# EasyEDA Pro project ProPrj_主控板v1.0_2025-02-24.epro, board PCB1_1
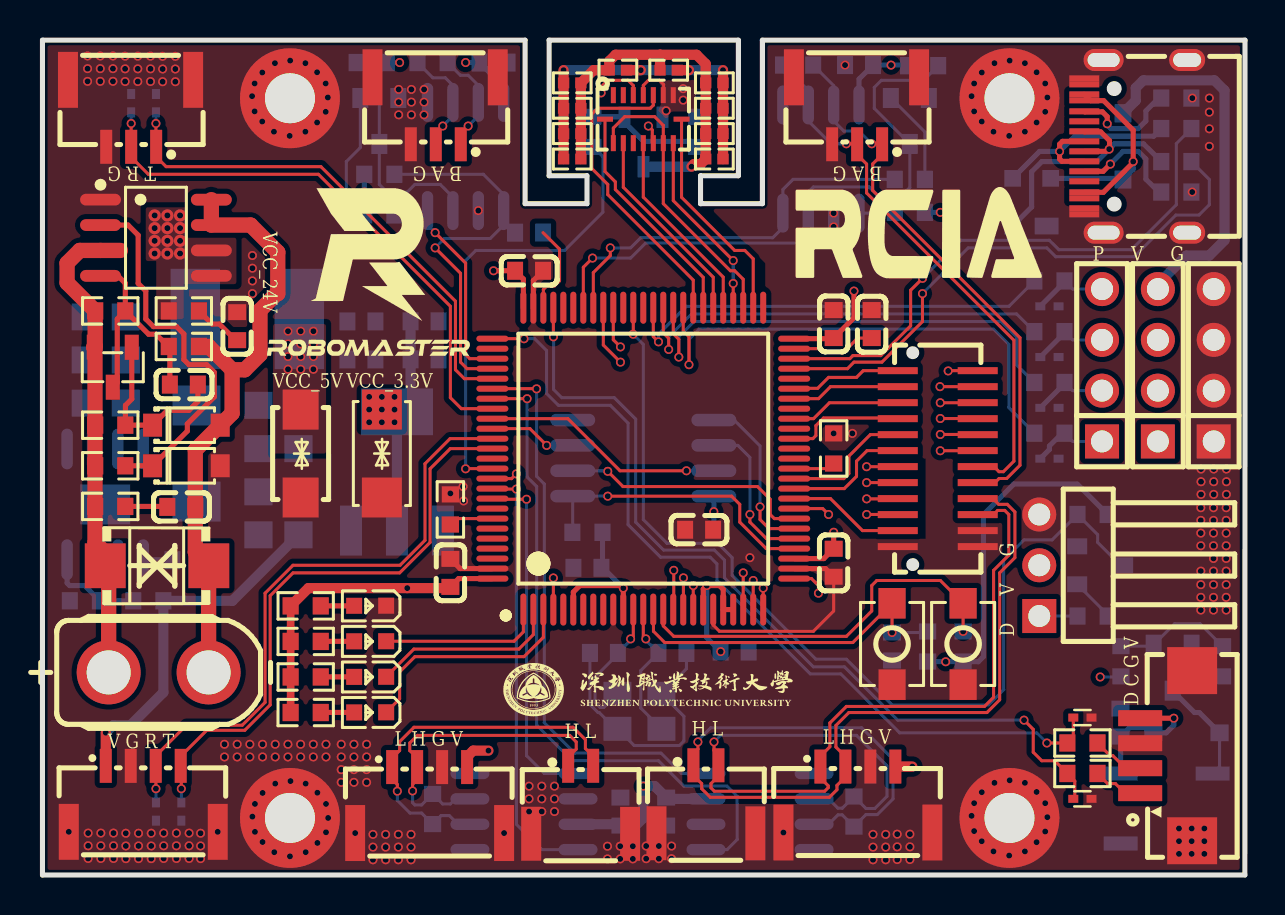
[diagram p10: board, top side]
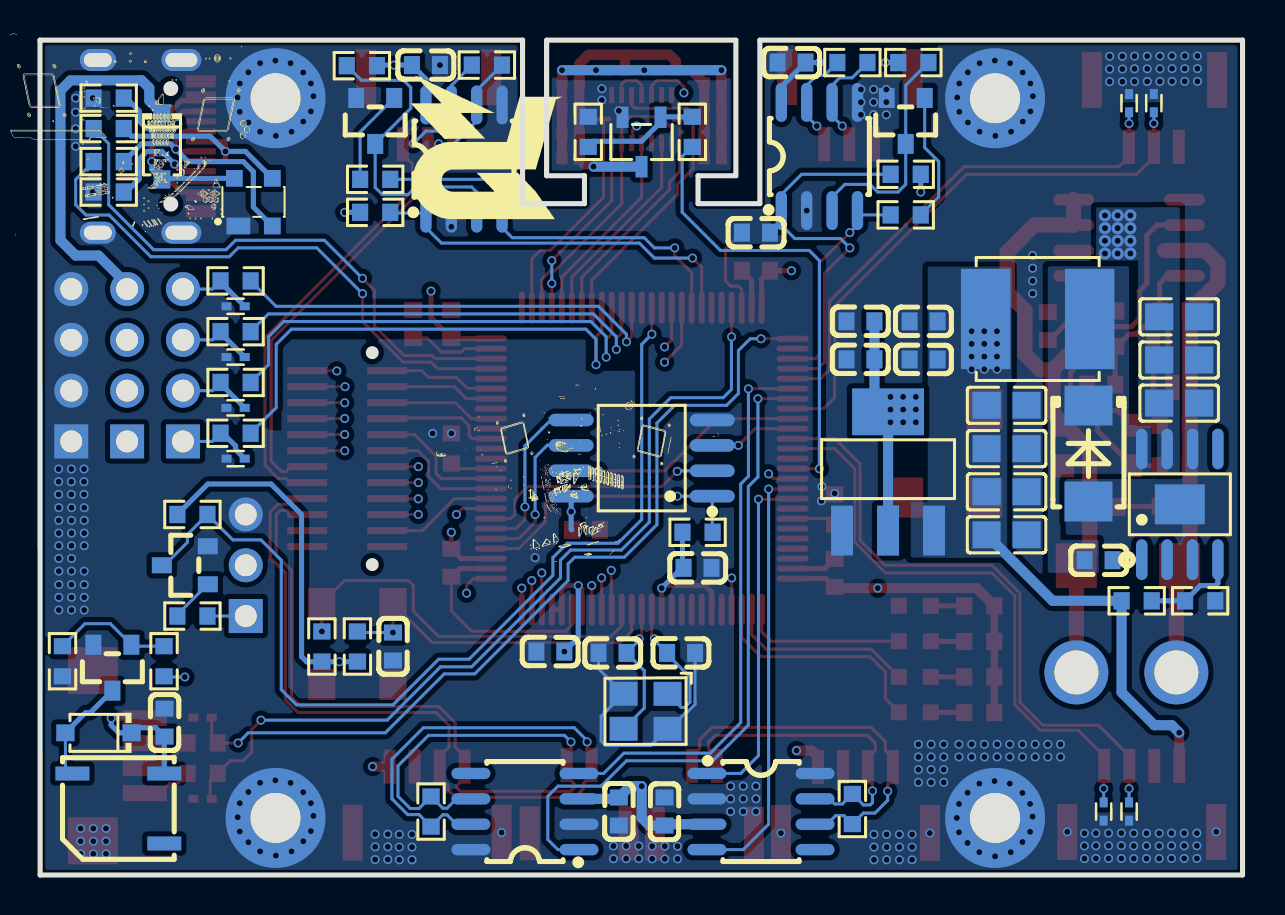
[diagram p11: board, bottom side, seen from below]

Outline 60.17 x 41.76 mm; copper layers: Top Layer, Inner1, Inner2, Bottom Layer. Coordinates in mm from the lower left corner of the outline.
Outline path: 0,0 0,41.76 24.15,41.76 24.15,33.58 27.24,33.58 27.24,34.98 25.35,34.98 25.35,41.76 34.82,41.76 34.82,34.98 32.93,34.98 32.93,33.58 36.02,33.58 36.02,41.76 60.17,41.76 60.16,0 0,0
Stack: Top Layer 0.035mm 外层铜厚1oz / Dielectric1 0.2104mm 7628 RC49% 8.6mil / Inner1 0.0152mm 内层铜厚 / Dielectric2 1.065mm 1.1mm H/HOZ 含铜 / Inner2 0.0152mm 内层铜厚 / Dielectric3 0.2104mm 7628 RC49% 8.6mil / Bottom Layer 0.035mm 外层铜厚1oz

## Design rules (mm)
net OSC_IN: OSC
net OSC_OUT: OSC
net CAN1-H: CAN1
net CAN1-L: CAN1
net CAN2-H: CAN2
net CAN2-L: CAN2
net RS485_1_B: RS485_1
net RS485_1_A: RS485_1
net RS485_4_B: RS485_4
net RS485_4_A: RS485_4
template: 自定义配置
spacing copperThickness1oz (default): track to track 0.102, other pairs 0.152 to 0.3
spacing copperThickness2oz: track to track 0.203, other pairs 0.152 to 0.3
track width copperThickness1oz (default): min 0.127, default 0.254, max 2.54
track width copperThickness2oz: min 0.203, default 0.254, max 2.54
differential pair differentialPair (default): width min 0.127, default 0.254, max 2.54; gap min 0.152, default 0.152
via viaSize (default): diameter min 0.3, default 0.3, max 10; hole min 0.3, default 0.45, max 6.3

## Placement (name value [footprint] x y rotation side)
BUZZER1  4kHz  [BUZ-SMD_L5.0-W5.5-P4.60]  56.25 3.33 0 bottom
C1  100nF  [C0603]  7.07 24.53 180 top
C3  1uF  [C0603]  6.95 18.42 180 top
C4  1uF  [C0603]  9.74 27.45 90 top
C8  100nF  [C0603]  7.2 15.75 0 bottom
C17  12pF  [C0603]  28.09 11.11 180 bottom
C18  12pF  [C0603]  31.52 11.11 0 bottom
C19  100nF  [C0603]  42.51 11.43 270 bottom
C54  100nF  [C0603]  31.2 3.17 270 bottom
C132  4.7uf  [C0805]  3.17 23.6 0 bottom
C133  4.7uf  [C0805]  3.17 25.76 0 bottom
C163  4.7uf  [C0805]  3.17 27.92 0 bottom
C164  4.7uf  [C0805]  11.81 17.02 0 bottom
C165  4.7uf  [C0805]  11.81 19.17 0 bottom
C166  4.7uf  [C0805]  11.81 21.33 0 bottom
C167  4.7uf  [C0805]  11.81 23.5 0 bottom
C170  100nF  [C0603]  34.63 11.18 180 bottom
C171  100nF  [C0603]  20.41 15.11 270 top
C174  100nF  [C0603]  27.27 15.37 0 bottom
C175  100nF  [C0603]  39.59 27.56 270 top
C176  100nF  [C0603]  24.35 30.23 180 top
C177  100nF  [C0603]  39.59 15.62 90 top
C178  100nF  [C0603]  28.92 3.17 90 bottom
C179  10nF  [C0603]  19.12 27.7 180 bottom
C180  100nF  [C0603]  19.12 25.79 180 bottom
C181  100nF  [C0603]  15.96 27.69 180 bottom
C182  100nF  [C0603]  15.96 25.79 180 bottom
C183  22uF  [C0603]  53.94 7.62 270 bottom
C184  100nF  [C0603]  41.49 27.56 90 top
C185  100nF  [C0603]  24.35 32.13 0 bottom
C186  100nF  [C0603]  32.86 17.27 0 top
C187  100nF  [C0603]  40.86 40.51 180 bottom
C188  100nF  [C0603]  22.57 40.64 0 bottom
CN1  HC-1.25-4PWT  [CONN-SMD_4P-P1.25-HC-1.25-4PWT]  56.22 5.97 90 top
CN10  XT30UPB-F30.G.Y  [CONN-TH_XT30UPB-F]  5.81 10.14 0 top
D4  -  [SMB_L4.6-W3.6-LS5.3-BI]  5.73 15.47 180 top
D5  SS34-SMB  [SMB_L4.4-W3.6-LS5.3-RD]  7.71 21.08 270 bottom
D6  ESD9B5.0ST5G  [SOD-923_L0.8-W0.6-LS1.0-BI]  52.03 7.87 180 top
D7  ESD9B5.0ST5G  [SOD-923_L0.8-W0.6-LS1.0-BI]  52.03 3.81 180 top
D8  PRTR5V0U2X  [SOT-143-4_L2.9-W1.3-P1.92-LS2.4-BL]  49.49 33.66 180 bottom
D10  ESD9B5.0ST5G  [SOD-923_L0.8-W0.6-LS1.0-BI]  50.38 20.83 180 bottom
D11  ESD9B5.0ST5G  [SOD-923_L0.8-W0.6-LS1.0-BI]  50.38 23.37 180 bottom
D12  ESD9B5.0ST5G  [SOD-923_L0.8-W0.6-LS1.0-BI]  50.38 25.91 180 bottom
D13  ESD9B5.0ST5G  [SOD-923_L0.8-W0.6-LS1.0-BI]  50.38 28.45 180 bottom
D15  ESD9B5.0ST5G  [SOD-923_L0.8-W0.6-LS1.0-BI]  5.68 3.17 90 bottom
D16  ESD9B5.0ST5G  [SOD-923_L0.8-W0.6-LS1.0-BI]  6.95 3.17 90 bottom
D19  ESD9B5.0ST5G  [SOD-923_L0.8-W0.6-LS1.0-BI]  5.68 38.61 270 bottom
D20  ESD9B5.0ST5G  [SOD-923_L0.8-W0.6-LS1.0-BI]  4.44 38.61 270 bottom
D21  SMAJ5.0CA  [SMA_L4.4-W2.8-LS5.1-BI]  12.92 21.08 90 top
D22  SMAJ3.3CA  [SMA_L4.3-W2.6-LS5.1-BI]  16.98 21.08 90 top
H2  -  [HDR-TH_4P-P2.54-V-M]  53.01 25.5 90 top
H3  -  [HDR-TH_4P-P2.54-V-M]  55.81 25.5 90 top
H4  -  [HDR-TH_4P-P2.54-V-M]  58.6 25.5 90 top
J1  GH1.25-4P  [CONN-SMD_4P-P1.25_GH1.25-4PLI]  19.37 3.75 0 top
J2  GH1.25-4P  [CONN-SMD_4P-P1.25_GH1.25-4PLI]  40.8 3.78 0 top
J4  GH1.25-4P  [CONN-SMD_4P-P1.25_GH1.25-4PLI]  5.04 3.81 0 top
L2  15uH  [IND-SMD_L6.0-W6.0_SWPA6045S]  10.25 27.81 0 bottom
LED2  -  [LED_0603]  16.35 13.46 180 top
LED3  -  [LED_0603]  16.35 11.68 180 top
LED4  -  [LED_0603]  16.35 9.91 180 top
LED5  -  [LED_0603]  16.35 8.13 180 top
NOREF  -  [Pad_e5538]  48.38 38.86 90 top
NOREF#2  -  [Pad_e5542]  12.38 38.85 90 top
NOREF#3  -  [Pad_e5541]  12.38 2.86 90 top
NOREF#4  -  [Pad_e5539]  48.38 2.86 90 top
Q6  -  [S8050_SOT-23]  52.92 15.37 180 bottom
Q29  NCE4614  [SOIC-8_L4.9-W3.9-P1.27-LS6.0-BL]  5.68 31.88 270 top
Q30  -  [SOT-23-3_L2.9-W1.3-P1.90-LS2.4-BR]  3.52 25.4 90 top
Q31  -  [S8050_SOT-23]  56.42 10.37 90 bottom
Q32  CJ2310  [SOT-23-3_L2.9-W1.6-P1.90-LS2.8-BR]  30.07 36.67 90 bottom
Q33  -  [S8050_SOT-23]  43.27 37.72 90 bottom
Q34  -  [S8050_SOT-23]  16.73 37.72 90 bottom
R2  100kΩ  [R0603]  3.39 20.47 180 top
R3  100kΩ  [R0603]  3.39 22.5 180 top
R4  22Ω  [R0603]  7.07 28.22 180 top
R6  10kΩ  [R0603]  3.39 28.22 180 top
R13  10K  [R0603]  44.29 11.43 270 bottom
R14  10K  [R0603]  13.17 13.46 0 top
R16  10K  [R0603]  20.41 18.29 270 top
R20  4.7k  [R0603]  5.3 13.72 0 bottom
R95  1.5k  [R0603]  2.12 13.72 0 bottom
R150  120R  [R0603]  19.52 3.3 90 bottom
R151  120R  [R0603]  40.6 3.17 270 bottom
R152  22Ω  [R0603]  3.39 18.44 180 top
R153  10kΩ  [R0603]  7.07 26.44 180 top
R154  4.7kΩ  [R0603]  52.54 18.03 180 bottom
R155  4.7kΩ  [R0603]  52.54 12.95 180 bottom
R156  22R  [R0603]  52.03 6.6 0 top
R157  22R  [R0603]  52.03 5.08 0 top
R158  10K  [R0603]  46.06 11.43 270 bottom
R159  10K  [R0603]  59.04 10.69 270 bottom
R160  22R  [R0603]  53.96 10.69 90 bottom
R161  22R  [R0603]  56.73 38.86 180 bottom
R162  22R  [R0603]  56.73 34.16 0 bottom
R163  100R  [R0603]  27.53 37.17 90 bottom
R164  10K  [R0603]  32.74 37.17 90 bottom
R165  470R  [R0402]  26.51 37.08 180 top
R166  470R  [R0402]  26.51 38.35 180 top
R167  470R  [R0402]  26.51 39.62 180 top
R168  470R  [R0402]  28.79 40.26 0 top
R169  470R  [R0402]  31.33 40.26 0 top
R170  470R  [R0402]  33.62 39.62 0 top
R171  470R  [R0402]  33.62 38.35 0 top
R172  470R  [R0402]  33.62 37.08 0 top
R173  470R  [R0402]  33.62 35.81 0 top
R174  470R  [R0402]  26.51 35.81 180 top
R175  10K  [R0603]  13.17 11.68 0 top
R176  10K  [R0603]  13.17 9.91 0 top
R177  10K  [R0603]  13.17 8.13 0 top
R178  22R  [R0603]  50.38 22.1 0 bottom
R179  22R  [R0603]  50.38 24.64 0 bottom
R180  22R  [R0603]  50.38 27.18 0 bottom
R181  22R  [R0603]  50.38 29.72 0 bottom
R182  22R  [R0603]  56.73 37.34 0 bottom
R183  22R  [R0603]  56.73 35.69 0 bottom
R184  10K  [R0603]  27.27 17.14 0 bottom
R185  10k  [R0603]  43.4 33.15 0 bottom
R186  120R  [R0603]  37.81 40.51 0 bottom
R187  10k  [R0603]  44.06 40.48 180 bottom
R188  10k  [R0603]  43.4 34.8 180 bottom
R189  10k  [R0603]  16.85 35.05 180 bottom
R190  120R  [R0603]  19.52 40.64 0 bottom
R191  10k  [R0603]  16.47 40.64 0 bottom
R192  10k  [R0603]  16.85 33.02 0 bottom
R193  10K  [R0603]  39.59 21.34 270 top
SW1  轻触按键3*4*H  [SW-SMD_L4.0-W2.9-LS5.0]  42.51 11.56 90 top
SW2  轻触按键3*4*H  [SW-SMD_L4.0-W2.9-LS5.0]  46.06 11.56 270 top
U1  STM32F407VET6  [LQFP-100_L14.0-W14.0-P0.50-LS16.0-BL]  30.06 20.83 0 top
U4  -  [SOIC-8_L5.0-W4.0-P1.27-LS6.0-BL-EP2.0]  3.14 18.54 180 bottom
U9  BMI088  [LGA-16_L4.5-W3.0-P0.50-BL]  30.06 37.81 270 top
U10  -  [SOIC-8_L5.0-W4.0-P1.27-LS6.0-BL]  24.09 3.17 270 bottom
U11  GH1.25-2P卧贴  [CONN-SMD_2P-P1.25_GH1.25-2P]  26.93 3.76 0 top
U12  -  [SOIC-8_L5.0-W4.0-P1.27-LS6.0-BL]  35.9 3.17 90 bottom
U14  GH1.25-2P卧贴  [CONN-SMD_2P-P1.25_GH1.25-2P]  33.19 3.79 0 top
U15  AMS1117-3.3  [SOT-223-3_L6.5-W3.4-P2.30-LS7.0-BR]  17.74 20.2 270 bottom
U18  X6511WR-03H-C30D60R2  [HDR-TH_3P-P2.54-H-M-W9.7-N]  49.87 15.49 90 top
U19  SD103AWS  [SOD-123_L2.7-W1.7-LS3.8-RD]  57.24 7.11 0 bottom
U20  SD103AWS  [SOD-123_L2.7-W1.7-LS3.8-RD]  54.06 36.45 270 bottom
U21  GH1.25-3P卧贴  [CONN-SMD_GH1.25-3P]  4.41 38.1 180 top
U22  W25Q64JVSSIQ  [SOIC-8_L5.3-W5.3-P1.27-LS8.0-BL]  30.06 20.86 90 bottom
U24  SP3485EN-L/TR  [SOIC-8_L5.0-W4.0-P1.27-LS6.0-BL]  38.95 35.81 180 bottom
U26  GH1.25-3P卧贴  [CONN-SMD_GH1.25-3P]  40.73 38.23 180 top
U27  SP3485EN-L/TR  [SOIC-8_L5.0-W4.0-P1.27-LS6.0-BL]  21.17 35.94 180 bottom
U28  GH1.25-3P卧贴  [CONN-SMD_GH1.25-3P]  19.65 38.23 180 top
U29  SGDBF-08-024P-H40  [CONN-SMD_24P-P0.80_SGDBF-08-024P-H40]  44.79 20.83 270 top
USB1  TYPE-C母座16P不绣钢  [TYPE-C-SMD_16P-EH4]  54.7 36.45 90 top
X3  12MHz  [OSC-SMD_4P-L3.2-W2.5-BL]  29.87 8.19 0 bottom
ZD1  MMSZ5239B  [SOD-123_L2.8-W1.8-LS3.7-RD]  7.2 20.47 0 top
ZD2  MMSZ5239B  [SOD-123_L2.8-W1.8-LS3.7-RD]  7.2 22.5 0 top

## Footprints (pads in the part's own frame, mm; a bottom-side part is the same pattern mirrored in y, then rotated)
BUZ-SMD_L5.0-W5.5-P4.60
  rect 1.7x0.7 smd: 1(-2.3,-1.75) 2(2.3,-1.75) 3(-2.3,1.75)
C0603
  rect 0.8x0.9 smd: 1(-0.7,0) 2(0.7,0)
C0805
  rect 1.41x1.35 smd: 1(-1,0) 2(1,0)
CONN-SMD_2P-P1.25_GH1.25-2P
  rect 0.6x1.7 smd: 1(-0.625,1.702) 2(0.625,1.702)
  rect 1x2.7 smd: 3(2.475,-1.702) 4(-2.475,-1.698)
CONN-SMD_4P-P1.25-HC-1.25-4PWT
  rect 0.8x2.2 smd: 1(-1.875,1.3) 2(-0.625,1.3) 3(0.625,1.3) 4(1.875,1.3)
  rect 2.35x2.5 smd: 5(4.255,-1.3) 6(-4.255,-1.3)
CONN-SMD_4P-P1.25_GH1.25-4PLI
  rect 0.6x1.7 smd: 1(-1.875,1.65) 2(-0.625,1.65) 3(0.625,1.65) 4(1.875,1.65)
  rect 1x2.8 smd: 5(-3.725,-1.65) 6(3.725,-1.65)
CONN-SMD_24P-P0.80_SGDBF-08-024P-H40
  rect 0.35x2 smd: 1(-4.4,-2) 2(-3.6,-2) 3(-2.8,-2) 4(-2,-2) 5(-1.2,-2) 6(-0.4,-2) 7(0.4,-2) 8(1.2,-2) 9(2,-2) 10(2.8,-2) 11(3.6,-2) 12(4.4,-2) 13(4.4,2) 14(3.6,2) 15(2.8,2) 16(2,2) 17(1.2,2) 18(0.4,2) 19(-0.4,2) 20(-1.2,2) 21(-2,2) 22(-2.8,2) 23(-3.6,2) 24(-4.4,2)
CONN-SMD_GH1.25-3P
  rect 0.6x1.7 smd: 1(-1.282,1.675) 2(-0.032,1.675) 3(1.218,1.675)
  rect 1x2.8 smd: 4(-3.132,-1.675) 5(3.132,-1.675)
CONN-TH_XT30UPB-F
  round 3.2 hole 2.2: 1(-2.5,0) 2(2.5,0)
HDR-TH_3P-P2.54-H-M-W9.7-N
  rect 1.7x1.7 hole 1.1: 1(-2.54,0)
  round 1.7 hole 1.1: 2(0,0) 3(2.54,0)
HDR-TH_4P-P2.54-V-M
  rect 1.7x1.7 hole 1.1: 1(-3.81,0)
  round 1.7 hole 1.1: 2(-1.27,0) 3(1.27,0) 4(3.81,0)
IND-SMD_L6.0-W6.0_SWPA6045S
  rect 2.474x5.02 smd: 1(-2.603,0) 2(2.603,0)
LED_0603
  rect 0.8x0.8 smd: 1(-0.851,-0.01) 2(0.75,-0.005)
LGA-16_L4.5-W3.0-P0.50-BL
  rect 0.8x0.25 smd: 1(-1.2,-1.498) 2(-1.2,-0.998) 3(-1.2,-0.498) 4(-1.2,0.002) 5(-1.2,0.502) 6(-1.2,1.002) 7(-1.2,1.502) 9(1.2,1.502) 10(1.2,1.002) 11(1.2,0.502) 12(1.2,0.002) 13(1.2,-0.498) 14(1.2,-0.998) 15(1.2,-1.498)
  rect 0.25x0.8 smd: 8(0,1.915) 16(0,-1.915)
LQFP-100_L14.0-W14.0-P0.50-LS16.0-BL
  oval 0.3x1.6 smd: 1(-6,-7.55) 2(-5.5,-7.55) 3(-5,-7.55) 4(-4.5,-7.55) 5(-4,-7.55) 6(-3.5,-7.55) 7(-3,-7.55) 8(-2.5,-7.55) 9(-2,-7.55) 10(-1.5,-7.55) 11(-1,-7.55) 12(-0.5,-7.55) 13(0,-7.55) 14(0.5,-7.55) 15(1,-7.55) 16(1.5,-7.55) 17(2,-7.55) 18(2.5,-7.55) 19(3,-7.55) 20(3.5,-7.55) 21(4,-7.55) 22(4.5,-7.55) 23(5,-7.55) 24(5.5,-7.55) 25(6,-7.55) 51(6,7.55) 52(5.5,7.55) 53(5,7.55) 54(4.5,7.55) 55(4,7.55) 56(3.5,7.55) 57(3,7.55) 58(2.5,7.55) 59(2,7.55) 60(1.5,7.55) 61(1,7.55) 62(0.5,7.55) 63(0,7.55) 64(-0.5,7.55) 65(-1,7.55) 66(-1.5,7.55) 67(-2,7.55) 68(-2.5,7.55) 69(-3,7.55) 70(-3.5,7.55) 71(-4,7.55) 72(-4.5,7.55) 73(-5,7.55) 74(-5.5,7.55) 75(-6,7.55)
  oval 1.6x0.3 smd: 26(7.55,-6) 27(7.55,-5.5) 28(7.55,-5) 29(7.55,-4.5) 30(7.55,-4) 31(7.55,-3.5) 32(7.55,-3) 33(7.55,-2.5) 34(7.55,-2) 35(7.55,-1.5) 36(7.55,-1) 37(7.55,-0.5) 38(7.55,0) 39(7.55,0.5) 40(7.55,1) 41(7.55,1.5) 42(7.55,2) 43(7.55,2.5) 44(7.55,3) 45(7.55,3.5) 46(7.55,4) 47(7.55,4.5) 48(7.55,5) 49(7.55,5.5) 50(7.55,6) 76(-7.55,6) 77(-7.55,5.5) 78(-7.55,5) 79(-7.55,4.5) 80(-7.55,4) 81(-7.55,3.5) 82(-7.55,3) 83(-7.55,2.5) 84(-7.55,2) 85(-7.55,1.5) 86(-7.55,1) 87(-7.55,0.5) 88(-7.55,0) 89(-7.55,-0.5) 90(-7.55,-1) 91(-7.55,-1.5) 92(-7.55,-2) 93(-7.55,-2.5) 94(-7.55,-3) 95(-7.55,-3.5) 96(-7.55,-4) 97(-7.55,-4.5) 98(-7.55,-5) 99(-7.55,-5.5) 100(-7.55,-6)
OSC-SMD_4P-L3.2-W2.5-BL
  rect 1.4x1.2 smd: 1(-1.1,-0.875) 2(1.1,-0.875) 3(1.1,0.875) 4(-1.1,0.875)
Pad_e5538
  round 5 hole 2.5: 101(0,0)
Pad_e5539
  round 5 hole 2.5: 101(0,0)
Pad_e5541
  round 5 hole 2.5: 101(0,0)
Pad_e5542
  round 5 hole 2.5: 101(0,0)
R0402
  rect 0.566x0.54 smd: 1(-0.433,0) 2(0.433,0)
R0603
  rect 0.806x0.864 smd: 1(-0.753,0) 2(0.753,0)
S8050_SOT-23
  rect 1x0.8 smd: 1(1.15,-0.823) 2(1.15,1.077) 3(-1.15,0.127)
SMA_L4.3-W2.6-LS5.1-BI
  rect 2x2 smd: 1(-2.2,0) 2(2.2,0)
SMA_L4.4-W2.8-LS5.1-BI
  rect 2x1.8 smd: 1(-2.2,0) 2(2.2,0)
SMB_L4.4-W3.6-LS5.3-RD
  rect 2x2.4 smd: 1(-2.4,0) 2(2.4,0)
SMB_L4.6-W3.6-LS5.3-BI
  rect 2.047x2.24 smd: 1(-2.591,0) 2(2.591,0)
SOD-123_L2.7-W1.7-LS3.8-RD
  rect 0.91x0.84 smd: 1(-1.655,0) 2(1.655,0)
SOD-123_L2.8-W1.8-LS3.7-RD
  rect 0.95x1.15 smd: 1(-1.692,0) 2(1.692,0)
SOD-923_L0.8-W0.6-LS1.0-BI
  rect 0.5x0.4 smd: 1(-0.457,0) 2(0.457,0)
SOIC-8_L4.9-W3.9-P1.27-LS6.0-BL
  oval 0.588x2.045 smd: 1(-1.905,-2.772) 2(-0.635,-2.772) 3(0.635,-2.772) 4(1.905,-2.772) 5(1.905,2.772) 6(0.635,2.772) 7(-0.635,2.772) 8(-1.905,2.772)
SOIC-8_L5.0-W4.0-P1.27-LS6.0-BL
  oval 0.569x1.95 smd: 1(-1.905,-2.705) 2(-0.635,-2.705) 3(0.635,-2.705) 4(1.905,-2.705) 5(1.905,2.705) 6(0.635,2.705) 7(-0.635,2.705) 8(-1.905,2.705)
SOIC-8_L5.0-W4.0-P1.27-LS6.0-BL-EP2.0
  oval 0.574x2.037 smd: 1(-1.905,-2.768) 2(-0.635,-2.768) 3(0.635,-2.768) 4(1.905,-2.768) 5(1.905,2.768) 6(0.635,2.768) 7(-0.635,2.768) 8(-1.905,2.768)
  rect 2.5x2 smd: 9(0,0)
SOIC-8_L5.3-W5.3-P1.27-LS8.0-BL
  oval 0.63x2.25 smd: 1(-1.905,-3.53) 2(-0.635,-3.53) 3(0.635,-3.53) 4(1.905,-3.53) 5(1.905,3.53) 6(0.635,3.53) 7(-0.635,3.53) 8(-1.905,3.53)
SOT-23-3_L2.9-W1.3-P1.90-LS2.4-BR
  rect 1.25x0.7 smd: 1(1,-0.95) 2(1,0.95) 3(-1,0)
SOT-23-3_L2.9-W1.6-P1.90-LS2.8-BR
  rect 1.07x0.6 smd: 1(1.235,-0.95) 2(1.235,0.95) 3(-1.235,0)
SOT-143-4_L2.9-W1.3-P1.92-LS2.4-BL
  rect 1.194x0.838 smd: 1(-0.75,-1.192)
  rect 0.838x0.838 smd: 2(0.95,-1.192) 3(0.95,1.192) 4(-0.95,1.192)
SOT-223-3_L6.5-W3.4-P2.30-LS7.0-BR
  rect 2.5x1.1 smd: 1(2.97,-2.3) 2(2.97,0) 3(2.97,2.3)
  rect 2.34x3.6 smd: 4(-2.97,0)
SW-SMD_L4.0-W2.9-LS5.0
  rect 1.53x1.36 smd: 1(-2.035,0) 2(2.035,0)
TYPE-C-SMD_16P-EH4
  oval 1.1x2 hole 0.7x1.6: 1(-4.32,1.606) 1(4.32,1.606)
  oval 1.1x1.8 hole 0.7x1.4: 1(-4.32,-2.574) 1(4.32,-2.574)
  rect 0.3x1.5 smd: A1(-3.4,2.573) A4(-2.6,2.573) A5(-1.25,2.573) A6(-0.25,2.573) A7(0.25,2.573) A8(1.25,2.574) A9(2.6,2.574) A12(3.4,2.573) B1(3.1,2.573) B4(2.3,2.574) B5(1.75,2.573) B6(0.75,2.573) B7(-0.75,2.573) B8(-1.75,2.574) B9(-2.3,2.573) B12(-3.1,2.573)

## Nets
As in the schematic, except:
GND: C4.2 C17.2 C18.2 C19.2 C54.2 C132.1 C133.1 C163.1 C164.1 C165.1 C166.1 C167.1 C170.1 C171.1 C174.1 C175.1 C176.1 C177.1 C178.2 C179.1 C180.1 C181.1 C182.1 C183.1 C184.2 C185.2 C186.2 C187.2 C188.2 CN1.3 CN1.5 CN1.6 D5.2 D6.1 D7.1 D8.1 D10.1 D11.1 D12.1 D13.1 D15.1 D16.1 D19.1 D20.1 D21.1 D22.1 H4.1 H4.2 H4.3 H4.4 J1.3 J1.5 J1.6 J2.3 J2.5 J2.6 J4.2 J4.5 J4.6 LED2.1 NOREF.101 NOREF#2.101 NOREF#3.101 NOREF#4.101 Q6.2 Q29.1 Q31.2 Q32.2 Q33.2 Q34.2 R16.1 R95.1 R159.2 R161.1 R162.2 R164.2 R193.1 SW1.1 SW2.2 U1.10 U1.20 U1.27 U1.74 U1.99 U4.6 U4.9 U9.4 U9.6 U9.7 U10.2 U10.8 U11.3 U11.4 U12.2 U12.8 U14.3 U14.4 U15.1 U18.3 U21.3 U21.4 U21.5 U22.4 U24.2 U24.5 U26.3 U26.4 U26.5 U27.2 U27.5 U28.3 U28.4 U28.5 U29.12 U29.13 U29.14 USB1.1 USB1.A1 USB1.A12 USB1.B1 USB1.B12 X3.2 X3.4 ZD1.2
GROUND: C3.1 CN10.2 D4.1 Q29.7 Q29.8 R153.1 ZD2.2
$2N1757: C1.1 Q30.1 R3.1 ZD2.1

Pads without a net: BUZZER1 3; U1 5 7 8 9 38 39 41 43 46 51 63 65 70 71 77 88 90 93 97 98; U4 2 3 5; U9 1 2 13; U10 5; U12 5; USB1 A8 B8

## Via types
v1: diameter 0.45, hole 0.3, Top Layer to Bottom Layer, 394 vias
v2: diameter 0.61, hole 0.305, Top Layer to Bottom Layer, 12 vias

## Routing (per net, layer and track width the routed paths; a pad name or vN(x,y) marks a point on that pad's centre or on a via; arc(x,y) is an arc through that point)
5V_FB: length 4.8
  Bottom Layer w0.254: R20.1 R95.2 2.11,14.48 1.36,14.48 1.23,14.61 1.23,15.77
GND: length 31.4
  Top Layer w0.152: U9.4 30.06,39.5 30.32,39.75 30.87,39.75 31.08,39.54 31.08,39.02 U9.6 ; C177.1 39.59,13.21 38.57,12.19 33.87,12.19 33.56,12.5 U1.20
  Top Layer w0.254: U1.99 20.89,15.33 C171.1 ; U1.27 39.18,15.33 C177.1 ; C176.1 24.56,29.74 U1.74
  Bottom Layer w0.152: C18.2 32.22,10.31 30.97,9.06 32.09,7.94 32.09,6.71 31.87,6.48 29.61,6.48 X3.4 28.67,7.31 27.85,8.13 27.8,8.13 27.39,8.53 27.39,8.69 27.39,8.69 C17.2
  vias: v1(1.32,2.16) v1(2.26,40.97) v1(2.26,40.33) v1(2.26,39.7) v1(2.28,2.1) v1(2.28,1.46) v1(2.28,0.83) v1(2.89,40.97) v1(2.89,40.33) v1(2.89,39.7) v1(2.92,2.1) v1(2.92,1.46) v1(2.92,0.83) v1(3.53,40.97) v1(3.53,40.33) v1(3.53,39.7) v1(3.55,2.1) v1(3.55,1.46) v1(3.55,0.83) v1(4.13,40.96) v1(4.13,40.33) v1(4.13,39.69) v1(4.17,2.09) v1(4.17,1.45) v1(4.17,0.82) v1(4.77,40.96) v1(4.77,40.33) v1(4.77,39.69) v1(4.81,2.09) v1(4.81,1.45) v1(4.81,0.82) v1(5.4,40.96) v1(5.4,40.33) v1(5.4,39.69) v1(5.44,2.09) v1(5.44,1.45) v1(5.44,0.82) v1(6.01,40.95) v1(6.01,40.32) v1(6.01,39.68) v1(6.07,2.1) v1(6.07,1.46) v1(6.07,0.83) v1(6.65,40.95) v1(6.65,40.32) v1(6.65,39.68) v1(6.7,2.1) v1(6.7,1.46) v1(6.7,0.83) v1(7.34,2.1) v1(7.34,1.46) v1(7.34,0.83) v1(7.91,2.09) v1(7.91,1.45) v1(7.91,0.82) v1(8.77,2.16) v1(9.11,6.54) v1(9.11,5.91) v1(9.74,6.54) v1(9.74,5.91) v1(10.38,6.54) v1(10.38,5.91) v1(10.49,38.96) v1(10.5,30.99) v1(10.5,30.35) v1(10.5,29.72) v1(10.5,29.08) v1(10.5,2.92) v1(10.62,39.59) v1(10.62,38.2) v1(10.63,3.56) v1(10.63,2.16) v1(11,40.14) v1(11,37.69) v1(11.01,6.54) v1(11.01,5.91) v1(11.01,1.65) v1(11.01,4.11) v1(11.58,37.18) v1(11.6,1.14) v1(11.63,40.61) v1(11.65,6.54) v1(11.65,5.91) v1(11.65,4.57) v1(12.28,6.54) v1(12.28,5.91) v1(12.39,40.74) v1(12.37,36.97) v1(12.41,4.7) v1(12.38,0.93) v1(12.92,6.54) v1(12.92,5.91) v1(13.16,40.61) v1(13.16,37.18) v1(13.17,4.57) v1(13.17,1.14) v1(13.55,6.54) v1(13.55,5.91) v1(13.74,40.15) v1(13.74,37.64) v1(13.76,4.12) v1(13.76,1.6) v1(14.17,39.59) v1(14.17,38.18) v1(14.19,6.54) v1(14.19,5.91) v1(14.19,3.56) v1(14.19,2.14) v1(14.28,38.89) v1(14.29,2.86) v1(14.95,6.54) v1(14.95,5.91) v1(14.95,5.27) v1(14.95,4.64) v1(15.58,6.54) v1(15.58,5.91) v1(15.58,5.27) v1(15.58,4.64) v1(15.65,2.1) v1(16.22,6.54) v1(16.22,5.91) v1(16.22,5.27) v1(16.22,4.64) v1(16.54,2.03) v1(16.54,1.4) v1(16.54,0.76) v1(17.17,2.03) v1(17.17,1.4) v1(17.17,0.76) v1(17.81,2.03) v1(17.81,1.4) v1(17.81,0.76) v1(17.82,39.3) v1(17.82,38.66) v1(17.82,38.03) v1(18.46,39.3) v1(18.46,38.66) v1(18.46,38.03) v1(18.44,2.03) v1(18.44,1.4) v1(18.44,0.76) v1(19.09,39.3) v1(19.09,38.66) v1(19.09,38.03) v1(20.41,19.09) v1(21.04,19.43) v1(21.07,18.71) v1(21.81,33.24) v1(23.1,2.1) v1(24.35,4.45) v1(24.35,3.81) v1(24.35,3.17) v1(24.98,4.45) v1(24.98,3.81) v1(24.98,3.17) v1(25.62,4.45) v1(25.62,3.81) v1(25.62,3.17) v1(28.27,1.44) v1(28.27,0.81) v1(28.9,1.44) v1(28.9,0.81) v1(29.54,1.44) v1(29.54,0.81) v1(30.2,1.45) v1(30.2,0.82) v1(30.84,1.45) v1(30.84,0.82) v1(31.2,38.23) v1(31.47,1.45) v1(31.47,0.82) v1(32.06,39.33) v1(32.06,38.76) v1(35.4,15.88) v1(37.07,2.12) v1(39.59,33.86) v1(39.59,33.11) v1(39.59,32.42) v1(39.59,22.09) v1(40.16,40.51) v1(40.52,22.09) v1(41.56,2.03) v1(41.56,1.4) v1(41.56,0.76) v1(42.19,2.03) v1(42.19,1.4) v1(42.19,0.76) v1(42.77,2.04) v1(42.77,1.41) v1(42.77,0.77) v1(43.4,2.04) v1(43.4,1.41) v1(43.4,0.77) v1(46.49,38.96) v1(46.49,2.96) v1(46.61,39.59) v1(46.61,38.2) v1(46.61,3.59) v1(46.61,2.2) v1(47,40.14) v1(47,37.69) v1(47,4.14) v1(47,1.69) v1(47.58,37.18) v1(47.58,1.18) v1(47.63,40.61) v1(47.63,4.61) v1(48.39,40.74) v1(48.37,36.97) v1(48.39,4.74) v1(48.37,0.97) v1(49.15,40.61) v1(49.15,37.18) v1(49.15,4.61) v1(49.15,1.18) v1(49.74,40.15) v1(49.74,37.64) v1(49.74,4.15) v1(49.74,1.64) v1(50.17,39.59) v1(50.17,38.18) v1(50.17,3.59) v1(50.17,2.18) v1(50.28,38.89) v1(50.28,2.89) v1(56.86,2.33) v1(56.86,1.69) v1(56.86,1.06) v1(57.5,2.33) v1(57.5,1.69) v1(57.5,1.06) v1(57.53,38.86) v1(57.53,34.16) v1(57.97,20.31) v1(57.97,19.67) v1(57.97,19.04) v1(57.96,18.37) v1(57.96,17.74) v1(57.96,17.1) v1(57.96,16.47) v1(57.96,15.2) v1(57.96,14.52) v1(57.96,13.89) v1(57.96,13.25) v1(58.13,2.33) v1(58.13,1.69) v1(58.13,1.06) v1(58.38,38.86) v1(58.38,38.16) v1(58.38,37.33) v1(58.38,36.45) v1(58.6,20.31) v1(58.6,19.67) v1(58.6,19.04) v1(58.59,18.37) v1(58.59,17.74) v1(58.59,17.1) v1(58.59,16.47) v1(58.59,15.84) v1(58.59,15.2) v1(58.59,14.52) v1(58.59,13.89) v1(58.59,13.25) v1(59.24,20.31) v1(59.24,19.67) v1(59.24,19.04) v1(59.23,18.37) v1(59.23,17.74) v1(59.23,17.1) v1(59.23,16.47) v1(59.23,15.84) v1(59.23,15.2) v1(59.23,14.52) v1(59.23,13.89) v1(59.23,13.25)
VCC_3.3V: length 131.2
  Top Layer w0.152: v1(30.32,37.47) 30.51,37.27 30.51,36.66 U9.11 ; U9.3 29.56,39.49 29.3,39.75 28.28,39.75 27.95,39.42 v1(27.95,39.12)
  Top Layer w0.254: v1(22.57,30.23) C176.2 24.06,29.81 U1.75 ; v1(39.59,17.14) 39.59,16.32 39.09,15.83 U1.28 ; U1.11 v1(29.06,14.35) 28.93,14.48 26.89,14.48 26.56,14.15 U1.6 ; U1.100 20.82,14.83 C171.2 ; v1(40.6,29.21) 40.6,27.88 39.56,26.83 U1.50 ; U1.22 U1.21 34.06,14.29 33.87,14.48 v1(33.24,14.48) 33.06,14.3 U1.19 ; CN1.4 v1(56.6,7.84)
  Top Layer w0.381: R14.1 R175.1 R176.1 R177.1
  Top Layer w0.508: C171.2 20.35,14.35 v1(18.25,14.35) 13.31,14.35 R14.1
  Inner1 w0.508: v1(27.95,39.12) 29.61,37.47 v1(30.32,37.47) 30.32,34.94 27.89,32.51 23.46,32.51 22.31,33.66 22.31,39.5 v1(21.17,40.64) v1(17.87,40.64) ; v1(56.6,7.84) 56.6,8.89 55.97,9.53 54.95,9.53 53.81,10.67 v1(45.19,10.67)
  Bottom Layer w0.254: 46.07,10.67 46.83,10.67 47.08,10.92 47.08,18.03 48.6,19.56 51.77,19.56 R154.1 ; 46.07,10.67 R158.2 ; 46.07,10.67 v1(45.19,10.67) 44.29,10.67 R13.2 ; R191.2 v1(17.87,40.64) ; R184.2 28.02,15.42 C174.2 28.05,15.37 v1(29.06,14.35) ; U24.8 40.86,39.81 41.56,40.51 v1(42.46,40.51) 43.28,40.51 R187.2 ; U27.8 23.08,39.43 C188.1 v1(21.17,40.64) ; v1(33.93,11.18) 33.24,11.87 v1(33.24,14.48) ; R185.2 v1(44.92,33.15) ; R189.2 v1(16.1,34.16) ; 33.56,17.27 33.59,17.31 v1(33.59,18.17) U22.8 ; v1(56.6,7.84) 56.6,7.49 56.22,7.11 U19.1 55.33,7.37 54.38,7.37 C183.2 53.95,6.91 BUZZER1.1
  Bottom Layer w0.508: C179.2 C180.2 18.42,23.85 U15.4 U15.2
  vias: v1(16.35,23.92) v1(16.35,23.28) v1(16.35,22.65) v1(16.98,23.92) v1(16.98,23.28) v1(16.98,22.65) v1(17.62,23.92) v1(17.62,23.28) v1(17.62,22.65)
VCC_5V: length 47.4
  Top Layer w0.508: J1.4 21.25,5.92 21.55,6.22 v1(22.31,6.22) ; v1(3.17,7.12) J4.1 ; 42.67,5.42 v1(43.52,5.42)
  Bottom Layer w0.508: H3.4 55.81,29.56 57.24,30.99 58.38,30.99 59.14,31.75 59.14,39.24 58.64,39.75 55.08,39.75 54.7,39.37 54.7,38.74 U20.1 ; v1(3.17,7.12) 3.54,7.49 4.41,7.49 6.05,9.14 R20.2 9.5,13.72 C164.2 ; U10.3 28.85,2.54 C178.1 29.68,2.47 30.06,2.86 v1(30.06,4.45) 30.63,4.45 C54.1 31.27,3.81 U12.3
  vias: v1(12.29,27.2) v1(12.29,26.57) v1(12.29,25.93) v1(12.29,25.3) v1(12.92,27.2) v1(12.92,26.57) v1(12.92,25.93) v1(12.92,25.3) v1(13.56,27.2) v1(13.56,26.57) v1(13.56,25.93) v1(13.56,25.3)
VCC_24V: length 18.2
  Top Layer w0.508: R173.2 R172.2 R171.2 R170.2 v1(34.05,40.26) ; 29.22,40.26 v1(29.93,40.26) ; R174.2 R165.2 R166.2 R167.2 v1(26.07,40.26) ; v1(32.35,40.26) R169.2
  Bottom Layer w0.508: v1(34.05,40.26) v1(32.35,40.26) v1(29.93,40.26) v1(26.07,40.26)
  vias: v2(5.61,32.99) v2(5.61,32.36) v2(5.61,31.72) v2(5.61,31.09) v2(6.25,32.99) v2(6.25,32.36) v2(6.25,31.72) v2(6.25,31.09) v2(6.88,32.99) v2(6.88,32.36) v2(6.88,31.72) v2(6.88,31.09)
(no net): length 1.3
  Top Layer w0.152: U1.90 23.47,19.83 v1(23.71,20.07)
ADC12_IN14: length 5.3
  Top Layer w0.152: v1(41.24,18.03) 42.79,18.03 U29.10 ; v1(39.33,18.03) 39.04,18.33 U1.33
  Inner1 w0.152: v1(39.33,18.03) v1(41.24,18.03)
ADC12_IN15: length 5.8
  Top Layer w0.152: U1.34 39.43,18.83 41.03,17.23 U29.11
ADC123_IN11: length 15.3
  Top Layer w0.152: v1(31.59,15.24) 31.59,13.3 U1.16 ; v1(41.23,20.42) 42.79,20.42 U29.7
  Inner1 w0.152: v1(31.59,15.24) 33.11,16.76 35.78,16.76 39.44,20.42 v1(41.23,20.42)
ADC123_IN12: length 14.3
  Top Layer w0.152: v1(41.23,19.63) U29.8 ; v1(32.07,14.86) 32.07,13.29 U1.17
  Inner1 w0.152: v1(32.07,14.86) 33.59,16.38 35.9,16.38 39.15,19.63 v1(41.23,19.63)
ADC123_IN13: length 13.2
  Top Layer w0.152: v1(41.24,18.82) 42.78,18.82 U29.9 ; v1(32.56,14.48) U1.18
  Inner1 w0.152: v1(32.56,14.48) 34.09,16 36.16,16 38.97,18.82 v1(41.24,18.82)
BOOT0: length 2.2
  Top Layer w0.152: U1.94 20.7,17.83 R16.2
BOOT1: length 2.1
  Top Layer w0.152: U1.37 39.33,20.33 R193.2
CAN1-H: length 51.6
  Top Layer w0.152: v1(32.79,6.66) 32.79,6.29 32.57,6.06 U14.1 32.57,4.98 32.98,4.57 32.98,4.32 33.41,3.89 39.37,3.89 39.75,4.27 39.75,4.48 40.17,4.91 40.17,5.92 39.7,6.4 39.7,7.48 40.35,8.13 47.26,8.13 47.89,8.76 47.89,15.11 48.65,15.88 48.65,18.16 48.27,18.54 47.84,18.54 47.56,18.83 U29.16
  Bottom Layer w0.152: U12.7 39.33,2.54 39.8,3.01 40.02,3.01 R151.2 41.2,3.02 41.77,3.02 42.56,3.81 42.56,5.79 40.98,7.37 33.44,7.37 32.79,6.72 v1(32.79,6.66)
CAN1-L: length 47.6
  Top Layer w0.152: U29.15 47.58,18.03 47.79,18.24 48.15,18.24 48.35,18.03 48.35,16 47.59,15.24 47.59,8.89 47.13,8.43 40.22,8.43 39.4,7.61 39.4,6.41 38.92,5.94 38.92,4.85 39.32,4.46 39.32,4.37 39.14,4.19 33.62,4.19 33.45,4.36 33.45,4.58 33.82,4.95 U14.2 33.82,6.02 33.6,6.24 v1(33.6,6.66)
  Bottom Layer w0.152: U12.6 39.33,3.81 39.8,3.34 40.02,3.34 R151.1 41.2,3.33 41.64,3.33 42.25,3.94 42.25,5.46 40.73,6.98 33.93,6.98 v1(33.6,6.66)
CAN1_RX: length 28.2
  Top Layer w0.152: v1(24.72,24.32) 24.71,24.33 U1.81
  Bottom Layer w0.152: v1(24.72,24.32) 24.72,19.94 25.11,19.56 25.11,7.62 26.63,6.1 30.95,6.1 31.97,5.08 U12.4
CAN1_TX: length 33.7
  Top Layer w0.152: U1.82 24.25,23.83 v1(24.25,23.83)
  Bottom Layer w0.152: v1(24.25,23.83) 24.25,19.91 24.73,19.43 24.73,7.49 26.51,5.72 30.82,5.72 32.09,4.45 34.25,4.45 34.76,3.94 34.76,1.78 34.25,1.27 U12.1
CAN2-H: length 16.7
  Top Layer w0.152: v1(18.52,4.21) 18.52,4.53 18.75,4.76 J1.2 18.75,5.86 18.38,6.22 18.38,6.6 18.76,6.98 26.38,6.98 26.71,6.66 26.71,6.3 26.3,5.89 U11.1
  Bottom Layer w0.152: v1(18.52,4.21) 18.52,3.62 18.63,3.51 18.97,3.51 R150.2 20.02,3.56 20.41,3.56 20.66,3.81 U10.7
CAN2-L: length 19
  Top Layer w0.152: v1(17.75,4.19) 17.75,4.52 17.5,4.78 J1.1 17.5,5.85 17.87,6.22 17.87,6.67 18.59,7.39 26.55,7.39 27.17,6.77 27.17,6.33 27.55,5.94 U11.2
  Bottom Layer w0.152: v1(17.75,4.19) 17.75,3.73 18.39,3.1 18.97,3.1 R150.1 19.94,2.97 20.36,2.97 20.79,2.54 U10.6
CAN2_RX: length 21.6
  Top Layer w0.152: U1.91 22.54,19.3 v1(23.71,19.3)
  Bottom Layer w0.152: v1(23.71,19.3) 23.71,2.54 24.98,1.27 U10.4
CAN2_TX: length 17.5
  Top Layer w0.152: v1(24.22,18.8) 22.54,18.8 U1.92
  Bottom Layer w0.152: U10.1 25.11,5.08 24.22,5.97 v1(24.22,18.8)
CS1_ACCEL: length 15.5
  Top Layer w0.152: U9.5 30.56,38.51 30.41,38.35 27.78,38.35 27.49,38.07 27.49,35.34 28.28,34.54 28.28,34.04 32.56,29.76 U1.58
CS1_GYRO: length 10.1
  Top Layer w0.152: U9.14 29.06,34.4 33.56,29.9 U1.56
G1: length 11.7
  Top Layer w0.254: R6.1 4.14,29.58 4.15,29.59 3.77,29.97 Q29.4 ; R6.1 5.31,27.05 5.68,27.05 6.29,26.44 R153.2 6.37,26.39 C1.2 ; R6.1 3.74,27.81 3.74,24.62 Q30.3
G2: length 19
  Top Layer w0.254: Q29.2 4.28,32.51 4.79,32 4.79,29.59 5.17,29.21 5.17,27.81 5.55,27.43 6.71,27.43 7.07,27.07 7.07,25.78 7.33,25.53 8.22,25.53 8.6,25.15 8.6,23.92 7.25,22.57 7.25,22.21 ZD1.1 R2.1
GROUND: length 30.7
  Top Layer w0.762: 9.49,25.27 8.32,26.44 R153.1 ; 9.49,25.27 10.12,25.27 10.88,26.03 10.88,28.25 11.72,29.08 11.77,29.08 11.77,31.15 10.41,32.51 Q29.7 Q29.8 ; 9.49,25.27 9.49,23.09 ZD2.2 7.65,21.26 C3.1 7.65,16.14 D4.1 8.31,15.46 CN10.2
HOLD_RESET: length 12.2
  Top Layer w0.152: U1.84 26.29,22.83 28.9,20.22 v1(32.22,20.22)
  Bottom Layer w0.152: U22.7 v1(32.22,20.22)
I2C3_SCL: length 24.4
  Top Layer w0.152: v1(28.92,25.65) 28.06,26.51 U1.67 ; v1(44.91,24.43) U29.23
  Inner1 w0.152: v1(44.91,24.43) 44.59,24.74 44.59,26.29 43.95,26.92 42.38,26.92 39.87,24.41 30.16,24.41 v1(28.92,25.65)
I2C3_SDA: length 23
  Top Layer w0.152: U29.24 45.33,25.23 v1(45.32,25.22) ; U1.66 28.56,26.77 v1(28.92,26.42)
  Inner1 w0.152: v1(45.32,25.22) 44.99,25.54 44.99,26.47 44.29,27.18 42.13,27.18 39.71,24.77 30.57,24.77 v1(28.92,26.42)
INT1_ACCEL: length 9.9
  Top Layer w0.152: U1.55 34.06,29.91 30.06,33.91 U9.12
INT1_GYRO: length 11.5
  Top Layer w0.152: U1.57 33.06,29.89 28.66,34.29 28.66,34.67 28.15,35.19 U9.16
LED_TEST_1: length 8.2
  Top Layer w0.152: LED3.1 23.59,11.69 24.06,12.16 U1.1
LED_TEST_2: length 9.5
  Top Layer w0.152: U1.2 24.56,12.03 23.84,11.3 18.58,11.3 LED4.1
LED_TEST_3: length 11.6
  Top Layer w0.152: U1.3 25.06,11.89 24.09,10.92 18.63,10.92 17.87,10.16 17.87,8.81 LED5.1
NRST: length 17.3
  Top Layer w0.152: U1.14 30.57,13.27 30.57,12.19 31.13,11.63 40.54,11.63 SW1.2 v1(42.51,12.13)
  Bottom Layer w0.152: v1(42.51,12.13) 44.23,12.13 R13.1
OSC_IN: length 6.9
  Top Layer w0.152: U1.12 29.56,11.95 v1(29.43,11.81)
  Bottom Layer w0.152: X3.1 28.09,8.38 27.9,8.38 27.65,8.64 27.65,9.91 28.79,11.05 C17.1 29.43,11.75 v1(29.43,11.81)
OSC_OUT: length 7.1
  Top Layer w0.152: U1.13 30.06,11.94 v1(30.19,11.81)
  Bottom Layer w0.152: 30.97,7.31 29.93,8.35 29.93,10.23 C18.1 30.19,11.74 v1(30.19,11.81)
PB0: length 6.4
  Top Layer w0.152: U1.35 40.12,19.33 40.73,19.94 40.73,20.7 41.26,21.23 U29.6
PB1: length 6.6
  Top Layer w0.152: U1.36 40.09,19.83 40.35,20.08 40.35,20.95 41.42,22.03 U29.5
PE9: length 5.9
  Top Layer w0.152: U29.4 42.76,22.86 39.08,22.86 38.7,22.48 38.7,21.98 38.54,21.83 U1.40
PE11: length 5.5
  Top Layer w0.152: U1.42 38.58,22.83 39.37,23.62 42.79,23.62 U29.3
PE13: length 5.4
  Top Layer w0.152: U29.2 39.43,24.43 38.83,23.83 U1.44
PE14: length 5.5
  Top Layer w0.152: U29.1 41.07,25.23 40.73,24.89 39.33,24.89 38.78,24.34 37.69,24.34
POWER: length 24.3
  Top Layer w0.762: CN10.1 3.31,15.3 D4.2 3.14,16.12 2.63,16.64 2.63,26.34 2.57,26.4 2.64,26.47 R6.2 1.23,29.62 1.23,30.61 1.87,31.24 Q29.3 3.9,31.24
RS485_1_A: length 27.5
  Top Layer w0.152: U29.18 47.61,20.43 47.86,20.17 48.08,20.17 48.6,20.7 48.6,26.75 41.23,34.12 41.23,35.56 40.76,36.04 U26.2 40.74,36.58 v1(40.22,36.58)
  Bottom Layer w0.152: R186.1 38.32,39.25 U24.6 38.32,37.72 39.46,36.58 v1(40.22,36.58)
RS485_1_B: length 27.9
  Top Layer w0.152: v1(41.49,36.58) 41.99,36.58 U26.1 42.01,36.04 41.54,35.57 41.54,34.24 48.91,26.87 48.91,20.5 48.25,19.83 47.86,19.83 47.66,19.63 U29.17
  Bottom Layer w0.152: R186.2 39.59,39.49 U24.7 39.59,37.72 40.09,37.21 40.86,37.21 v1(41.49,36.58)
RS485_4_A: length 5.5
  Top Layer w0.152: U28.2 19.68,37.12 v1(20.03,37.47)
  Bottom Layer w0.152: v1(20.03,37.47) 20.54,37.97 U27.6 20.54,39.5 20.16,39.88 19.53,39.88 R190.1
RS485_4_B: length 5.3
  Top Layer w0.152: v1(21.3,37.47) 20.93,37.1 U28.1
  Bottom Layer w0.152: v1(21.3,37.47) 21.81,37.97 U27.7 21.81,39.5 21.3,40.01 20.91,40.01 R190.2
SPI1_MISO: length 8.4
  Top Layer w0.152: v1(35.9,18.42) 35.9,17.78 36.36,17.33 U1.31
  Bottom Layer w0.152: U22.5 34.61,22.76 35.9,21.46 v1(35.9,18.42)
SPI1_MOSI: length 12.5
  Top Layer w0.152: U1.32 36.62,17.83 36.41,18.03 36.41,18.8 35.78,19.43 29.05,19.43 v1(28.28,20.19)
  Bottom Layer w0.152: U22.2 28.26,20.22 v1(28.28,20.19)
SPI1_NSS: length 14.5
  Top Layer w0.152: v1(28.28,18.95) 34.48,18.95 34.89,18.54 34.89,17.65 36.21,16.33 U1.29
  Bottom Layer w0.152: R184.1 26.53,17.16 U22.1 v1(28.28,18.95)
SPI1_SCK: length 7.8
  Top Layer w0.152: v1(35.4,18.03) 35.4,17.65 36.22,16.83 U1.30
  Bottom Layer w0.152: v1(35.4,18.03) 35.4,20.89 34.79,21.49 U22.6
SPI2_MISO: length 14.6
  Top Layer w0.152: U9.15 28.56,37.36 29.13,37.93 30.63,37.93 31.06,37.5 U9.10 31.06,33.58 34.42,30.23 34.63,30.23 35.06,29.8 U1.53
SPI2_MOSI: length 9.5
  Top Layer w0.152: v1(34.56,30.73) 31.56,33.73 U9.9 ; 34.56,29.59 U1.54
  Bottom Layer w0.152: v1(34.56,30.73) v1(34.56,29.59)
SPI2_SCK: length 11.2
  Top Layer w0.152: U9.8 31.98,33.9 34.63,31.24 35.14,31.24 35.56,30.82 U1.52
SWCLK: length 43.3
  Top Layer w0.152: v1(24.09,26.82) 24.09,26.83 U1.76 ; D6.2 51.58,6.9 R156.1 v1(50.25,6.6)
  Bottom Layer w0.152: v1(24.09,26.82) 24.63,26.82 25.22,26.23 25.22,24.09 25.81,23.5 28.41,23.5 29.3,22.61 29.3,17.53 30.93,15.9 33.41,15.9 33.74,15.56 33.74,14.73 38.42,10.06 39.94,10.06 42.89,7.11 49.75,7.11 v1(50.25,6.6)
SWDIO: length 43.4
  Top Layer w0.152: D7.2 51.65,3.89 51.65,4.7 51.28,5.07 R157.1 50.64,5.72 50,5.72 49.57,6.14 49.57,7.29 v1(49.11,7.75) ; U1.72 25.56,26.92 v1(25.56,26.92)
  Bottom Layer w0.152: v1(49.11,7.75) 42.79,7.75 40.13,10.41 38.57,10.41 34.13,14.86 34.13,15.75 33.62,16.26 31.08,16.26 29.68,17.65 29.68,22.81 28.61,23.88 25.98,23.88 25.57,24.29 25.57,26.91 v1(25.56,26.92)
TIM2_CH2: length 23.1
  Top Layer w0.152: v1(21.17,20.32) 21.18,20.33 U1.89
  Bottom Layer w0.152: v1(21.17,20.32) 21.17,30.73 21.68,31.24 26.12,31.24 28.04,33.16 28.04,35.94 27.56,36.42 R163.1
TIM4_CH1: length 25.7
  Top Layer w0.152: v1(32.35,25.53) 32.35,26.92 32.06,27.21 U1.59
  Bottom Layer w0.152: R178.1 48.35,23.38 48.35,26.54 47.59,27.31 32.86,27.31 32.35,26.8 v1(32.35,25.53)
TIM4_CH2: length 23.8
  Top Layer w0.152: v1(31.84,25.91) 31.84,26.8 31.56,27.08 U1.60
  Bottom Layer w0.152: R179.1 49.62,24.64 48.73,25.53 48.73,26.92 47.97,27.69 32.6,27.69 31.84,26.92 v1(31.84,25.91)
TIM4_CH3: length 22
  Top Layer w0.152: v1(31.33,26.29) 31.33,26.85 31.06,27.12 U1.61
  Bottom Layer w0.152: v1(31.33,26.29) 31.33,26.92 32.47,28.07 48.74,28.07 R180.1
TIM4_CH4: length 22.1
  Top Layer w0.152: v1(30.82,26.67) 30.56,26.93 U1.62
  Bottom Layer w0.152: v1(30.82,26.67) 30.82,27.05 32.22,28.45 48.36,28.45 R181.1
TIM5_CH1: length 19
  Top Layer w0.152: v1(35.06,15.11) U1.23 ; v1(44.92,23.62) 46.79,23.62 U29.22
  Inner1 w0.152: v1(35.06,15.11) 35.44,15.49 36.16,15.49 37.05,16.38 40.86,16.38 43.02,18.54 43.02,21.72 v1(44.92,23.62)
TIM5_CH2: length 17.8
  Top Layer w0.152: v1(44.92,22.83) 46.79,22.83 U29.21 ; U1.24 v1(35.56,14.73)
  Inner1 w0.152: v1(35.56,14.73) 35.94,15.11 36.41,15.11 37.3,16 41.11,16 43.4,18.29 43.4,21.31 v1(44.92,22.83)
TIM5_CH3: length 16.7
  Top Layer w0.152: U29.20 46.78,22.04 v1(44.92,22.04) ; U1.25 v1(36.06,14.35)
  Inner1 w0.152: v1(36.06,14.35) 37.33,15.62 41.36,15.62 43.78,18.03 43.78,20.89 v1(44.92,22.04)
TIM5_CH4: length 14.3
  Top Layer w0.152: v1(44.92,21.22) 46.79,21.22 U29.19 ; 37.59,14.78 37.61,14.8 U1.26 38.47,14.83 38.82,14.48 v1(38.82,14.1)
  Inner1 w0.152: v1(44.92,21.22) 44.16,20.46 44.16,17.78 40.48,14.1 v1(38.82,14.1)
TIM9_CH1: length 32
  Top Layer w0.152: U1.4 v1(25.56,14.86)
  Inner1 w0.152: v1(52.92,9.91) 42.89,9.91 39.97,12.83 32.22,12.83 30.19,14.86 v1(25.56,14.86)
  Bottom Layer w0.152: v1(52.92,9.91) 53.93,9.91 R160.1
UART4_RX: length 19.3
  Top Layer w0.152: v1(19.65,31.37) 20.92,30.1 20.92,25.65 21.24,25.33 U1.79
  Bottom Layer w0.152: R189.1 22.06,35.05 23.08,34.04 U27.1 23.08,32.51 22.4,31.84 20.12,31.84 v1(19.65,31.37)
UART4_TX: length 11.2
  Top Layer w0.152: v1(19.65,32.13) 21.17,30.61 21.17,26.03 21.38,25.83 U1.78
  Bottom Layer w0.152: v1(19.65,32.13) 19.27,32.51 U27.4 19.05,33.02 R192.2
UART5_RX: length 28.2
  Top Layer w0.152: v1(4.44,37.59) 4.44,36.43 ; 4.44,36.42 4.44,35.91 5.3,35.05 13.81,35.05 20.41,28.45 20.41,23.88 20.96,23.33 U1.83
  Bottom Layer w0.152: D20.2 v1(4.44,37.59)
UART5_TX: length 25.7
  Top Layer w0.152: v1(5.68,37.59) 5.68,36.44 5.69,36.42 5.69,35.93 6.19,35.43 13.93,35.43 20.66,28.7 20.66,25.27 21.11,24.83 U1.80
  Bottom Layer w0.152: D19.2 v1(5.68,37.59)
USART1_RX: length 19.2
  Top Layer w0.152: U1.69 27.06,30.4 v1(27.52,30.86)
  Bottom Layer w0.152: R185.1 42.6,33.11 U24.1 40.86,32.39 40.08,31.61 30.17,31.61 29.43,30.86 v1(27.52,30.86)
USART1_TX: length 20.1
  Top Layer w0.152: v1(28.41,31.37) 28.41,30.98 27.56,30.13 U1.68
  Bottom Layer w0.152: R188.2 37.55,34.8 37.05,34.29 U24.4 37.05,32.39 36.54,31.88 29.93,31.88 29.43,31.37 v1(28.41,31.37)
USART2_RX: length 29.6
  Top Layer w0.152: U1.87 20.4,21.33 19.39,20.32 19.39,16.64 17.87,15.11 12.54,15.11 11.39,13.97 11.39,8.51 10.12,7.24 8.22,7.24 6.92,5.94 J4.4 6.95,5.43 v1(6.95,4.32)
  Bottom Layer w0.152: D16.2 v1(6.95,4.32)
USART2_TX: length 30.9
  Top Layer w0.152: J4.3 5.68,5.45 v1(5.68,4.32) ; U1.86 20.39,21.83 19.14,20.57 19.14,16.74 17.89,15.49 12.54,15.49 11.14,14.1 11.14,8.64 10,7.49 7.2,7.49 5.67,5.96 5.67,5.71
  Bottom Layer w0.152: D15.2 v1(5.68,4.32)
USART6_RX: length 48.2
  Top Layer w0.152: v1(29.55,27.05) 29.56,27.06 U1.64
  Bottom Layer w0.152: v1(29.55,27.05) 30.06,26.54 30.06,17.78 31.25,16.59 33.79,16.59 34.51,15.88 34.51,14.99 38.7,10.8 40.22,10.8 42.51,8.51 47.33,8.51 48.1,9.27 48.1,15.75 49.11,16.76 50.52,16.76 R154.2 52.79,17.03 52.79,16.64 53.94,15.49 Q6.3
USB-DM: length 11.8
  Top Layer w0.254: USB1.A7 51.03,36.7 50.89,36.55 v1(50.89,36.2) 50.89,35.81 51,35.7 USB1.B7
  Bottom Layer w0.254: R182.1 55.6,36.96 51.65,36.96 v1(50.89,36.2) 49.89,36.2 48.54,34.85
USB-DP: length 13.7
  Top Layer w0.254: USB1.A6 53.22,36.2 53.39,36.37 53.39,36.73 52.95,37.17 52.15,37.17 USB1.B6
  Bottom Layer w0.254: R183.1 55.09,36.58 53.64,36.58 v1(53.37,36.31) 52.75,35.69 50,35.69 49.49,35.18 49.49,33.41 48.54,32.46
USB_VBUS: length 12.6
  Top Layer w0.254: USB1.A9 52.44,38.73 53.1,38.73 54.57,37.26 v1(54.57,35.69) 54.57,35.64 53.08,34.15 USB1.B9
  Bottom Layer w0.254: v1(54.57,35.69) 54.57,35.3 U20.2 54.01,34.85 D8.4
USER_KEY: length 19.8
  Top Layer w0.152: U1.15 31.06,12.46 31.59,11.94 40.22,11.94 41.49,13.21 41.49,14.48 41.75,14.73 44.92,14.73 SW2.1 v1(46.06,12.18)
WP: length 4.4
  Top Layer w0.152: U1.85 24.39,22.33 v1(25.23,21.49)
  Bottom Layer w0.152: v1(25.23,21.49) U22.3
$1N2558: length 1.7
  Top Layer w0.254: LED2.2 15.59,13.46 R14.2
$1N3908: length 4.2
  Top Layer w0.152: U1.49 38.91,26.33 39.08,26.16 40.09,26.16 40.79,26.86 41.49,26.86
$1N3911: length 4.7
  Top Layer w0.152: 25.05,32.13 25.87,31.31 25.87,29.72 25.62,29.46 25.24,29.46 25.06,29.29 U1.73
$1N8906: length 27.9
  Top Layer w0.152: v1(44.03,29.85) 43.44,29.25 43.44,27.47 41.94,25.98 40.55,25.98 40.4,25.83 U1.48
  Bottom Layer w0.152: R182.2 56.73,36.58 56.73,33.53 54.48,31.28 50.85,31.28 50.38,31.75 45.94,31.75 v1(44.03,29.85)
$1N9014: length 27.9
  Top Layer w0.152: v1(44.03,29.08) 44.03,27.68 42,25.65 40.6,25.65 40.28,25.33 U1.47
  Bottom Layer w0.152: v1(44.03,29.08) 46.32,31.37 50.25,31.37 50.7,30.93 54.62,30.93 56.71,33.01 57.87,33.01 58.38,33.53 58.38,34.79 R183.2
$1N10722: length 2.5
  Top Layer w0.152: R157.2 53.29,4.57 53.68,4.57 54.16,4.09 CN1.1
$1N10751: length 2.7
  Top Layer w0.152: CN1.2 54.18,5.34 53.56,5.97 53.42,5.97 R156.2
$2N1752: length 2.1
  Top Layer w0.254: R152.1 6.22,18.44 C3.2
$2N1755: length 2.5
  Top Layer w0.254: R4.1 8.49,27.56 8.85,27.56 9.66,26.75 C4.1
$2N1757: length 9
  Top Layer w0.254: Q30.1 4.47,23.81 4.15,23.5 4.15,22.51 R3.1 ZD2.1 6.25,23.24 7.33,23.24 7.77,23.69 7.77,24.53
$2N2663: length 1.5
  Bottom Layer w0.254: U4.1 6.48,15.77 C8.1
$3N1653: length 2.2
  Bottom Layer w0.152: R155.1 53.29,13.02 Q6.1
$3N1654: length 1.9
  Bottom Layer w0.152: U18.1 R155.2
$3N2642: length 5.4
  Bottom Layer w0.152: BUZZER1.2 58.89,5.42 U19.2
  Bottom Layer w0.254: Q31.3 57.64,8.13 57.88,8.13 U19.2
$3N2793: length 6
  Bottom Layer w0.152: R160.2 55.52,11.45 Q31.1 56.65,12.57 57.91,12.57 R159.1
$3N2963: length 5.7
  Top Layer w0.254: v1(53.43,35.56) 53.07,35.2 USB1.A5
  Bottom Layer w0.254: 55.98,34.04 55.21,34.81 55.21,35.81 54.83,36.2 54.06,36.2 v1(53.43,35.56)
$3N2969: length 5.4
  Top Layer w0.254: USB1.B5 52.15,38.17 53.03,38.17 53.27,37.93 v1(53.27,37.58)
  Bottom Layer w0.254: 55.98,38.99 55.21,38.22 55.21,37.72 54.83,37.34 53.46,37.34 53.27,37.52 v1(53.27,37.58)
$3N3573: length 6
  Bottom Layer w0.254: R163.2 29.09,37.93 29.12,37.9 29.12,37.65 30.07,36.7 32.45,36.7 R164.1
$3N3908: length 19.9
  Top Layer w0.508: 30.9,40.26 30.9,41.03 30.9,41.03 ; v1(32.47,35.43) 32.6,35.56 32.93,35.56 R173.1 R172.1 R171.1 R170.1 33.18,40.57 32.73,41.03 30.9,41.03 ; 30.9,41.03 28.67,41.03 28.36,40.72 R168.1 27.57,40.26 R167.1 R166.1 R165.1 R174.1
  Bottom Layer w0.508: Q32.3 30.07,35.43 v1(32.47,35.43)
$3N4093: length 1.7
  Top Layer w0.254: R175.2 13.93,11.69 LED3.2
$3N4149: length 1.7
  Top Layer w0.254: LED4.2 13.93,9.91 R176.2
$3N4204: length 1.7
  Top Layer w0.254: LED5.2 13.93,8.13 R177.2
$3N4509: length 3.9
  Bottom Layer w0.152: R178.2 51.54,21.69 H2.1
  Bottom Layer w0.254: R178.2 51.02,22.1 50.38,21.46 50.38,21.28 D10.2
$3N4516: length 3.8
  Bottom Layer w0.152: R179.2 51.54,24.23 H2.2
  Bottom Layer w0.254: R179.2 51.13,24.58 D11.2
$3N4547: length 3.8
  Bottom Layer w0.152: H2.3 51.54,26.77 R180.2
  Bottom Layer w0.254: D12.2 51.13,27.12 R180.2
$3N4554: length 3.8
  Bottom Layer w0.152: R181.2 51.54,29.31 H2.4
  Bottom Layer w0.254: R181.2 51.13,29.66 D13.2
$3N10667: length 4.8
  Bottom Layer w0.152: 42.45,38.87 44.15,37.17 R188.1
$3N10700: length 15.9
  Bottom Layer w0.152: U24.3 38.32,34.16 38.57,34.42 41.36,34.42 41.75,34.04 43.04,34.04 43.4,34.39 Q33.3 41.62,38.35 41.62,39.4 41.97,39.75 44.08,39.75 R187.1
$3N11131: length 6.5
  Bottom Layer w0.152: 15.9,38.87 15.9,36.39 15.2,35.69 15.2,33.92 R192.1
$3N11141: length 11.5
  Bottom Layer w0.152: U27.3 20.54,33.91 19.9,34.54 18.63,34.54 18.25,34.16 17.23,34.16 16.85,34.54 Q34.3 16.85,39.51 R191.1

## Copper pours and planes (outline as drawn; the poured copper is in the pictures)
GND on Top Layer: -3.07,42.91 62.47,42.91 62.59,43.04 62.59,-5.1 62.21,-5.48 -2.68,-5.48 -3.7,-6.49 -3.7,42.27
GND on Bottom Layer: -4.6,44.24 62.21,44.24 62.33,44.12 62.33,-1.35 60.43,-3.26 -4.98,-3.26 -4.98,43.86
GND on Inner1: -2.61,43.18 63.44,43.18 63.88,42.74 63.88,-1.33 61.34,-3.87 -2.41,-3.87 -2.61,-3.68
GND on Inner2: 0.26,27.78 59.91,27.78 59.91,0.26 0.26,0.26
GND on Inner2: 0.26,41.5 16.47,41.5 16.47,35.82 0.26,35.82
VCC_3.3V on Inner2: 0.26,41.48 45.55,41.48 45.55,9.4 0.26,9.4
VCC_5V on Top Layer: 11.53,27.56 14.19,27.56 14.19,21.08 11.53,21.08
VCC_5V on Bottom Layer: 14.06,18.67 16.6,18.67 16.6,15.88 13.81,15.88 13.81,18.42
VCC_5V on Bottom Layer: 11.55,30.44 15.75,30.44 15.75,15.88 11.77,15.88 11.77,24.74 11.55,24.74
VCC_5V on Inner2: 10.98,41.46 59.91,41.46 59.91,3.62 10.98,3.62
VCC_24V on Top Layer: 5.17,33.4 7.2,33.4 7.2,31.88 9.7,31.88 9.7,29.56 7.07,29.56 7.07,29.56 7.07,27.81 5.69,27.81 5.69,30.71 5.17,30.71
VCC_24V on Bottom Layer: 4.53,33.4 7.33,33.4 7.33,30.73 5.22,30.73 5.22,22.74 5.18,22.7 4.28,22.7 4.28,20.06 3.14,20.06 3.14,33.41 4.53,33.41
VCC_24V on Inner2: 4.16,41.45 39.08,41.45 39.08,30.76 4.16,30.76
$2N2664 on Bottom Layer: 5.68,30.45 9.74,30.45 9.74,15.11 7.19,15.11 7.19,16.76 9.1,16.76 9.1,20.07 4.57,20.07 4.57,22.5 5.66,22.5 5.68,22.48

## Text on the board
Top Silkscreen Layer: VCC_5V | VCC_3.3V | H L | T R G | VCC_24V | V G R T | L H G V | P     V     G | D     V     G | D C G V | B A G
